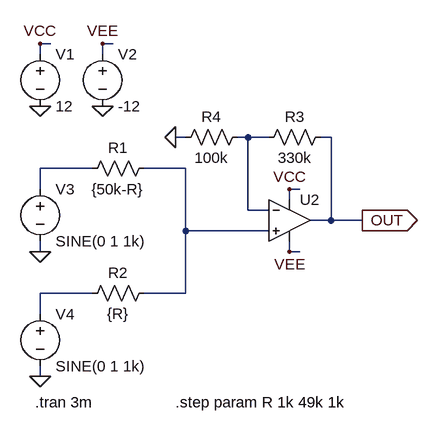
[diagram p0: schematic Dry_Wet_NonInv_Test_01.asc]
Dry_Wet_NonInv_Test_01.asc, the LTspice schematic file:
Version 4
SHEET 1 892 680
WIRE 0 -112 -16 -112
WIRE 96 -112 80 -112
WIRE -16 -96 -16 -112
WIRE 80 -96 80 -112
WIRE 208 32 192 32
WIRE 304 32 288 32
WIRE 336 32 304 32
WIRE 432 32 416 32
WIRE 64 80 -16 80
WIRE 208 80 144 80
WIRE -16 112 -16 80
WIRE 384 112 368 112
WIRE 368 128 368 112
WIRE 304 144 304 32
WIRE 336 144 304 144
WIRE 432 160 432 32
WIRE 432 160 400 160
WIRE 480 160 432 160
WIRE 208 176 208 80
WIRE 336 176 208 176
WIRE -16 208 -16 192
WIRE 368 208 368 192
WIRE 384 208 368 208
WIRE 64 272 -16 272
WIRE 208 272 208 176
WIRE 208 272 144 272
WIRE -16 304 -16 272
WIRE -16 400 -16 384
FLAG 480 160 OUT
IOPIN 480 160 Out
FLAG -16 -16 0
FLAG 80 -16 0
FLAG -16 -112 VCC
FLAG 80 -112 VEE
FLAG -16 208 0
FLAG -16 400 0
FLAG 368 112 VCC
FLAG 368 208 VEE
FLAG 192 32 0
SYMBOL res 160 64 R90
WINDOW 0 0 56 VBottom 2
WINDOW 3 32 56 VTop 2
SYMATTR InstName R1
SYMATTR Value {50k-R}
SYMBOL res 160 256 R90
WINDOW 0 0 56 VBottom 2
WINDOW 3 32 56 VTop 2
SYMATTR InstName R2
SYMATTR Value {R}
SYMBOL voltage -16 -112 R0
WINDOW 123 0 0 Left 0
WINDOW 39 0 0 Left 0
SYMATTR InstName V1
SYMATTR Value 12
SYMBOL voltage 80 -112 R0
WINDOW 123 0 0 Left 0
WINDOW 39 0 0 Left 0
SYMATTR InstName V2
SYMATTR Value -12
SYMBOL voltage -16 96 R0
WINDOW 123 0 0 Left 0
WINDOW 39 0 0 Left 0
SYMATTR InstName V3
SYMATTR Value SINE(0 1 1k)
SYMBOL voltage -16 288 R0
WINDOW 123 0 0 Left 0
WINDOW 39 0 0 Left 0
SYMATTR InstName V4
SYMATTR Value SINE(0 1 1k)
SYMBOL Opamps\\UniversalOpamp2 368 160 R0
SYMATTR InstName U2
SYMBOL res 432 16 R90
WINDOW 0 0 56 VBottom 2
WINDOW 3 32 56 VTop 2
SYMATTR InstName R3
SYMATTR Value 330k
SYMBOL res 304 16 R90
WINDOW 0 0 56 VBottom 2
WINDOW 3 32 56 VTop 2
SYMATTR InstName R4
SYMATTR Value 100k
TEXT -24 440 Left 2 !.tran 3m
TEXT 192 440 Left 2 !.step param R 1k 49k 1k

The netlist it stands for:
* Dry_Wet_NonInv_Test_01.asc
R1 N003 N002 {50k-R}
R2 N003 N004 {R}
V1 VCC 0 12
V2 VEE 0 -12
V3 N002 0 SINE(0 1 1k)
V4 N004 0 SINE(0 1 1k)
XU2 N003 N001 VCC VEE OUT level.2 Avol=1Meg GBW=10Meg Slew=10Meg ilimit=25m rail=0 Vos=0 phimargin=45 en=0 enk=0 in=0 ink=0 Rin=500Meg  ; pins IN+ IN- V+ V- OUT
R3 OUT N001 330k
R4 N001 0 100k
.tran 3m
.step param R 1k 49k 1k
.lib UniversalOpamps2.sub
.backanno
.end